# Altium schematic sheet fat41.SchDoc
size A3
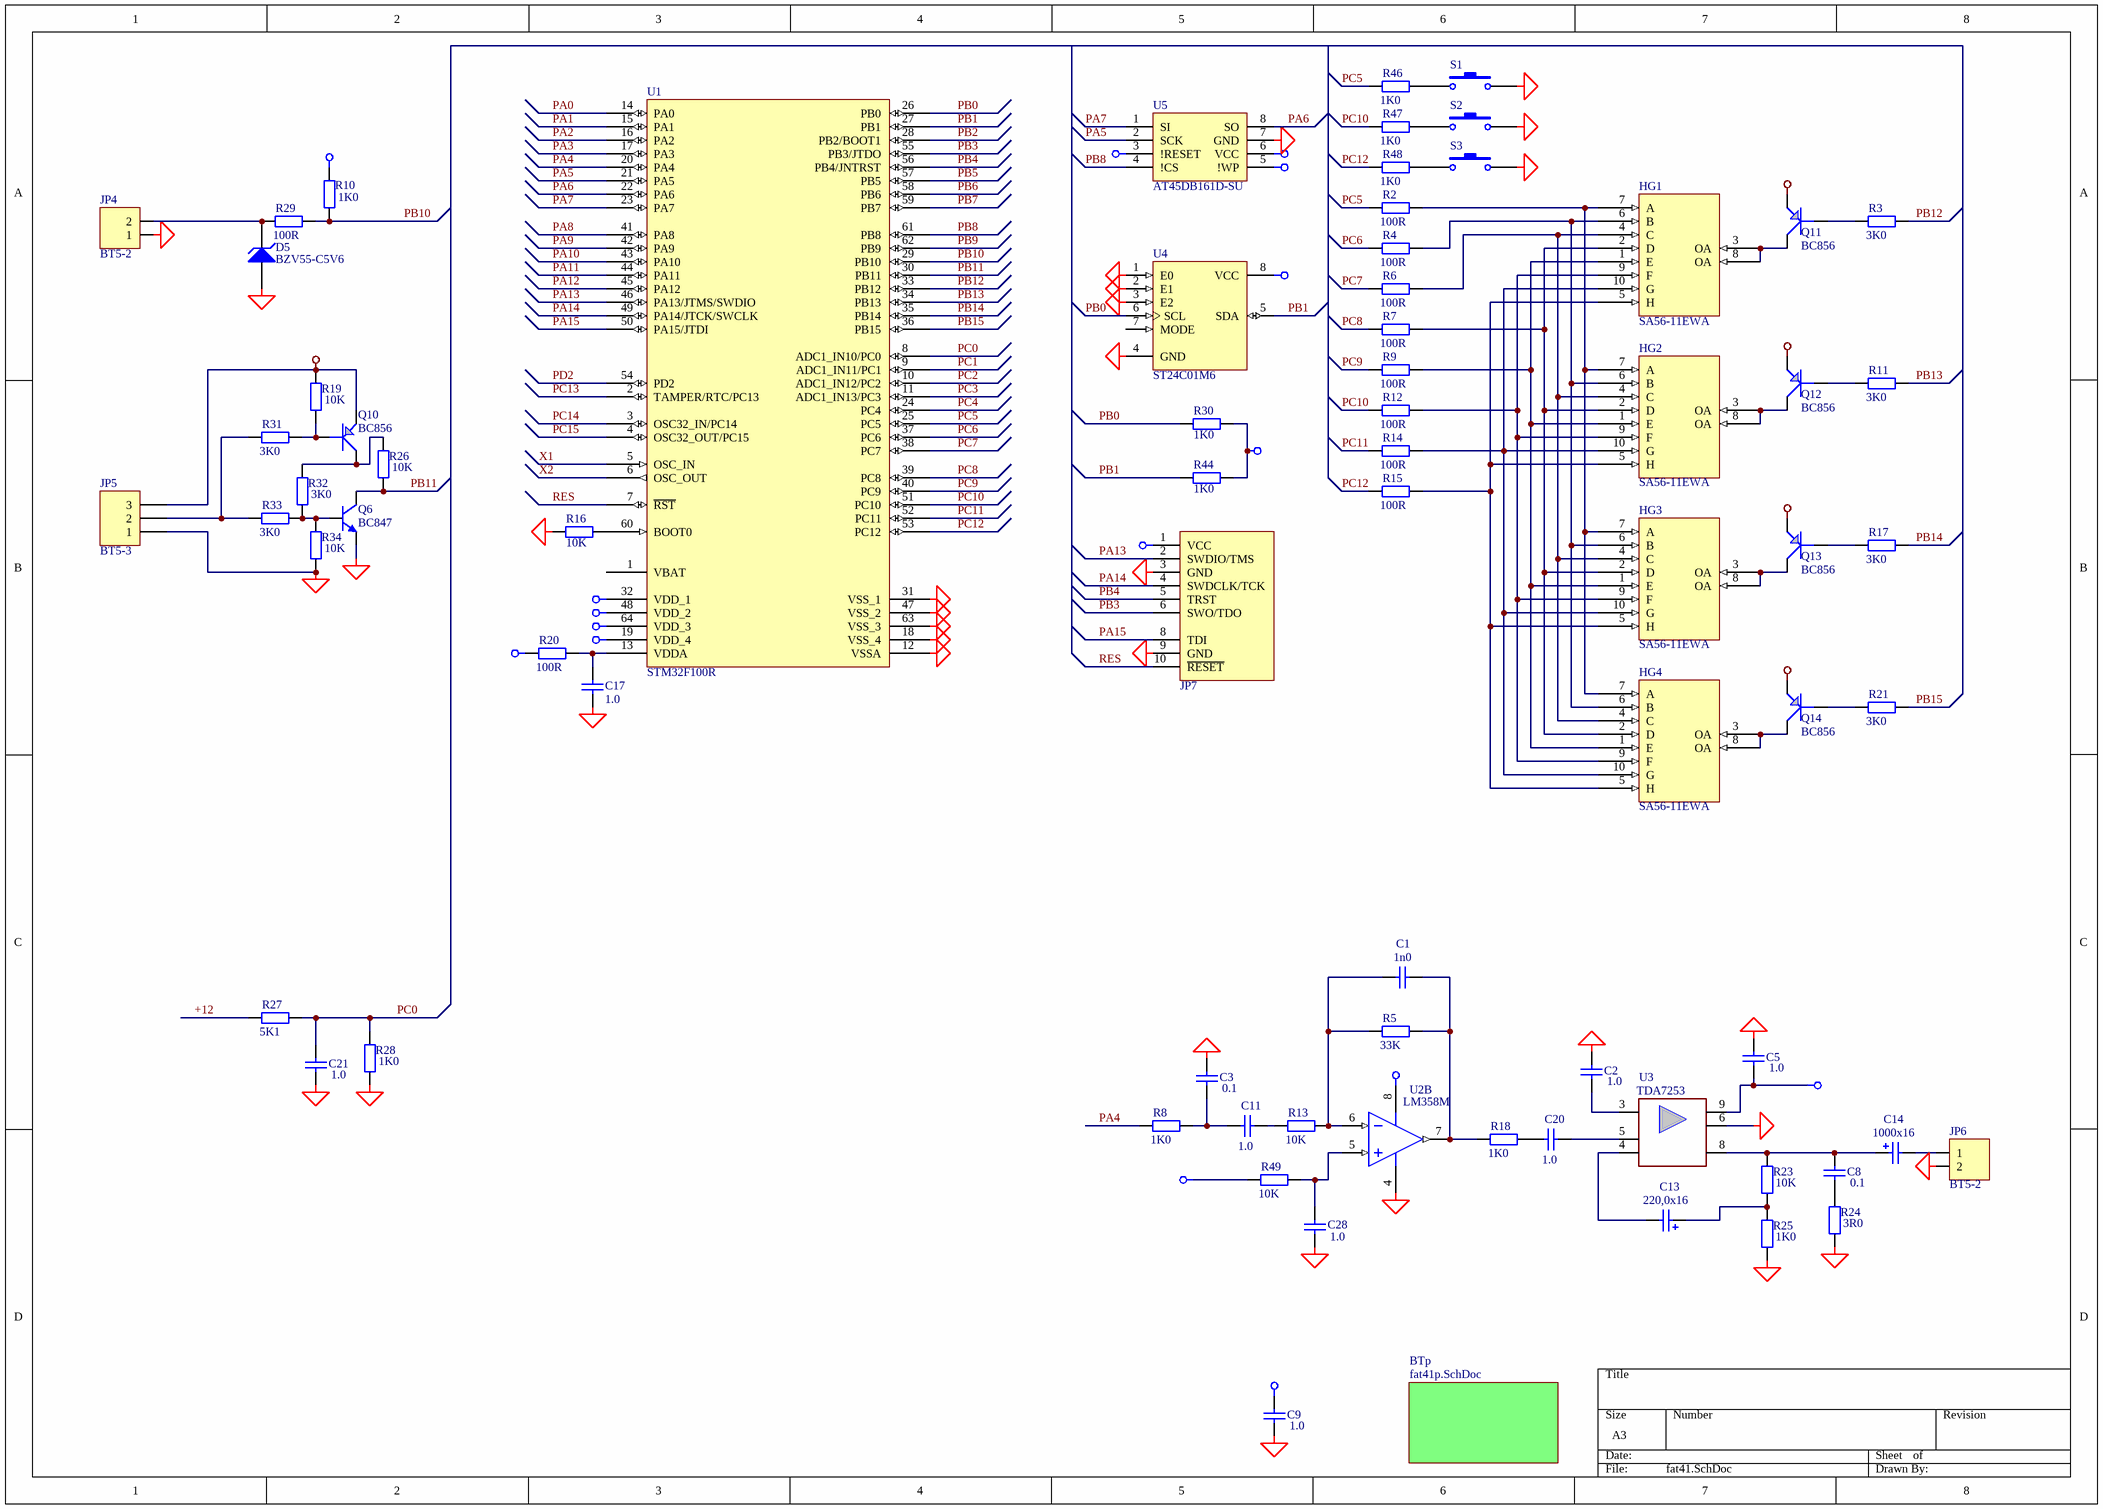
[diagram p0: fat41.SchDoc]

## Parts
C1  1n0  [_1206]
C2  1.0  [C3216-1206]
C3  0.1  [_1206]
C5  1.0  [C3216-1206]
C8  0.1  [C3216-1206]
C9  1.0  [C3216-1206]
C11  1.0  [_1206]
C13  220,0x16  [el3]
C14  1000x16  [el5]
C17  1.0  [_1206]
C20  1.0  [_1206]
C21  1.0  [_1206]
C28  1.0  [_1206]
D5  BZV55-C5V6  [_1206d]
HG1  SA56-11EWA  [DIP10]
HG2  SA56-11EWA  [DIP10]
HG3  SA56-11EWA  [DIP10]
HG4  SA56-11EWA  [DIP10]
JP4  BT5-2  [BT5-2-1]
JP5  BT5-3  [BT5-3]
JP6  BT5-2  [BT5-2-1]
JP7  CORTEX_DEBUG_CONNECTOR_PAL  [CORTEX_DEBUG_CONNECTOR]  (value not drawn)
Q6  BC847  [SO-G3]
Q10  BC856  [SO-G3]
Q11  BC856  [SO-G3]
Q12  BC856  [SO-G3]
Q13  BC856  [SO-G3]
Q14  BC856  [SO-G3]
R2  100R  [_1206]
R3  3K0  [_1206]
R4  100R  [_1206]
R5  33K  [_1206]
R6  100R  [_1206]
R7  100R  [_1206]
R8  1K0  [_1206]
R9  100R  [_1206]
R10  1K0  [_1206]
R11  3K0  [_1206]
R12  100R  [_1206]
R13  10K  [_1206]
R14  100R  [_1206]
R15  100R  [_1206]
R16  10K  [_1206]
R17  3K0  [_1206]
R18  1K0  [_1206]
R19  10K  [_1206]
R20  100R  [_1206]
R21  3K0  [_1206]
R23  10K  [_1206]
R24  3R0  [_1206]
R25  1K0  [_1206]
R26  10K  [_1206]
R27  5K1  [_1206]
R28  1K0  [_1206]
R29  100R  [_1206]
R30  1K0  [_1206]
R31  3K0  [_1206]
R32  3K0  [_1206]
R33  3K0  [_1206]
R34  10K  [_1206]
R44  1K0  [_1206]
R46  1K0  [_1206]
R47  1K0  [_1206]
R48  1K0  [_1206]
R49  10K  [_1206]
S1  SWT-6  [SWT-6-9]  (value not drawn)
S2  SWT-6  [SWT-6-9]  (value not drawn)
S3  SWT-6  [SWT-6-9]  (value not drawn)
U1  STM32F100R  [F-QFP10X10-G64/N]
U2  LM358M  [SO-G8]  (part B of 2)
U3  TDA7253  [Clipwatt11]
U4  ST24C01M6  [SO-G8]
U5  AT45DB161D-SU  [at45w]

## Sub-sheets
BTp = fat41p.SchDoc: no entries

## Nets
+3v3: C9.2 JP7.1(VCC) Q11.2(E) Q12.2(E) Q13.2(E) Q14.2(E) R10.1 R20.2 R30.2 R44.2 R49.2 U1.19(VDD_4) U1.32(VDD_1) U1.48(VDD_2) U1.64(VDD_3) U4.8(VCC) U5.3(!RESET) U5.5(!WP) U5.6(VCC)
+12v: C5.1 JP5.3 Q10.2(E) R19.2 U2.8(V+) U3.9
GND: C2.2 C3.2 C5.2 C9.1 C17.2 C21.1 C28.2 D5.1(A) JP4.1 JP5.1 JP6.2 JP7.3(GND) JP7.9(GND) Q6.2(E) R16.1 R24.1 R25.1 R28.2 R34.2 S1.2 S2.2 S3.2 U1.12(VSSA) U1.18(VSS_4) U1.31(VSS_1) U1.47(VSS_2) U1.63(VSS_3) U2.4(GND) U3.6 U4.1(E0) U4.2(E1) U4.3(E2) U4.4(GND) U5.7(GND)
+12: R27.2
PA0: U1.14(PA0)
PA1: U1.15(PA1)
PA2: U1.16(PA2)
PA3: U1.17(PA3)
PA4: R8.2 U1.20(PA4)
PA5: U1.21(PA5) U5.2(SCK)
PA6: U1.22(PA6) U5.8(SO)
PA7: U1.23(PA7) U5.1(SI)
PA8: U1.41(PA8)
PA9: U1.42(PA9)
PA10: U1.43(PA10)
PA11: U1.44(PA11)
PA12: U1.45(PA12)
PA13: JP7.2(SWDIO/TMS) U1.46(PA13/JTMS/SWDIO)
PA14: JP7.4(SWDCLK/TCK) U1.49(PA14/JTCK/SWCLK)
PA15: JP7.8(TDI) U1.50(PA15/JTDI)
PB0: R30.1 U1.26(PB0) U4.6(SCL)
PB1: R44.1 U1.27(PB1) U4.5(SDA)
PB2: U1.28(PB2/BOOT1)
PB3: JP7.6(SWO/TDO) U1.55(PB3/JTDO)
PB4: JP7.5(TRST) U1.56(PB4/JNTRST)
PB5: U1.57(PB5)
PB6: U1.58(PB6)
PB7: U1.59(PB7)
PB8: U1.61(PB8) U5.4(!CS)
PB9: U1.62(PB9)
PB10: R10.2 R29.1 U1.29(PB10)
PB11: Q6.3(C) R26.2 U1.30(PB11)
PB12: R3.2 U1.33(PB12)
PB13: R11.2 U1.34(PB13)
PB14: R17.2 U1.35(PB14)
PB15: R21.2 U1.36(PB15)
PC0: C21.2 R27.1 R28.1 U1.8(ADC1_IN10/PC0)
PC1: U1.9(ADC1_IN11/PC1)
PC2: U1.10(ADC1_IN12/PC2)
PC3: U1.11(ADC1_IN13/PC3)
PC4: U1.24(PC4)
PC5: R2.1 R46.1 U1.25(PC5)
PC6: R4.1 U1.37(PC6)
PC7: R6.1 U1.38(PC7)
PC8: R7.1 U1.39(PC8)
PC9: R9.1 U1.40(PC9)
PC10: R12.1 R47.1 U1.51(PC10)
PC11: R14.1 U1.52(PC11)
PC12: R15.1 R48.1 U1.53(PC12)
PC13: U1.2(TAMPER/RTC/PC13)
PC14: U1.3(OSC32_IN/PC14)
PC15: U1.4(OSC32_OUT/PC15)
PD2: U1.54(PD2)
RES: JP7.10(~{RESET}) U1.7(~{RST})
X1: U1.5(OSC_IN)
X2: U1.6(OSC_OUT)
NetC1_1: C1.1 R5.1 R18.1 U2.7(OUT)
NetC1_2: C1.2 R5.2 R13.1 U2.6(IN-)
NetC2_1: C2.1 U3.3(MUTE)
NetC3_1: C3.1 C11.1 R8.1
NetC8_1: C8.1 R24.2
NetC8_2: C8.2 C14.1 R23.2 U3.8
NetC11_2: C11.2 R13.2
NetC13_1: C13.1 R23.1 R25.2
NetC13_2: C13.2 U3.4
NetC14_2: C14.2 JP6.1
NetC17_1: C17.1 R20.1 U1.13(VDDA)
NetC20_1: C20.1 R18.2
NetC20_2: C20.2 U3.5(+)
NetC28_1: C28.1 R49.1 U2.5(IN+)
NetD5_2: D5.2(K) JP4.2 R29.2
NetHG1_1: HG1.1(E) HG2.1(E) HG3.1(E) HG4.1(E) R9.2
NetHG1_2: HG1.2(D) HG2.2(D) HG3.2(D) HG4.2(D) R7.2
NetHG1_3: HG1.3(OA) HG1.8(OA) Q11.3(C)
NetHG1_4: HG1.4(C) HG2.4(C) HG3.4(C) HG4.4(C) R6.2
NetHG1_5: HG1.5(H) HG2.5(H) HG3.5(H) HG4.5(H) R15.2
NetHG1_6: HG1.6(B) HG2.6(B) HG3.6(B) HG4.6(B) R4.2
NetHG1_7: HG1.7(A) HG2.7(A) HG3.7(A) HG4.7(A) R2.2
NetHG1_9: HG1.9(F) HG2.9(F) HG3.9(F) HG4.9(F) R12.2
NetHG1_10: HG1.10(G) HG2.10(G) HG3.10(G) HG4.10(G) R14.2
NetHG2_3: HG2.3(OA) HG2.8(OA) Q12.3(C)
NetHG3_3: HG3.3(OA) HG3.8(OA) Q13.3(C)
NetHG4_3: HG4.3(OA) HG4.8(OA) Q14.3(C)
NetJP5_2: JP5.2 R31.2 R33.2
NetQ6_1: Q6.1(B) R32.2 R33.1 R34.1
NetQ10_1: Q10.1(B) R19.1 R31.1
NetQ10_3: Q10.3(C) R26.1 R32.1
NetQ11_1: Q11.1(B) R3.1
NetQ12_1: Q12.1(B) R11.1
NetQ13_1: Q13.1(B) R17.1
NetQ14_1: Q14.1(B) R21.1
NetR16_2: R16.2 U1.60(BOOT0)
NetR46_2: R46.2 S1.1
NetR47_2: R47.2 S2.1
NetR48_2: R48.2 S3.1

Not connected (* = marked no-connect by the designer): U1 1(VBAT); U4 7(MODE)

## Library data of the parts
C1 = Cap Semi: Capacitor (Semiconductor SIM Model); Manufacturer: Generic Components; Class I: Passive; Value: 1000; Published: 8-Jun-2000; Revision: July-2002: Re-released for DXP Platform.; Publisher: Altium Limited; Class II: Capacitor
C2 C3 C5 C8 C17 = Cap Semi: Capacitor (Semiconductor SIM Model); Manufacturer: Generic Components; Class I: Passive; Value: 0,1; Published: 8-Jun-2000; Revision: July-2002: Re-released for DXP Platform.; Publisher: Altium Limited; Class II: Capacitor
C9 C21 = Cap Semi: Capacitor (Semiconductor SIM Model); Manufacturer: Generic Components; Class I: Passive; Value: 1,0; Published: 8-Jun-2000; Revision: July-2002: Re-released for DXP Platform.; Publisher: Altium Limited; Class II: Capacitor
C11 C20 C28 = Cap Semi: Capacitor (Semiconductor SIM Model); Manufacturer: Generic Components; Class I: Passive; Published: 8-Jun-2000; Revision: July-2002: Re-released for DXP Platform.; Publisher: Altium Limited; Class II: Capacitor; Value: 1.0
C13 C14 = Cap Pol1: Polarized Capacitor (Radial); Manufacturer: Generic Components; Class I: Passive; Value: 220,0; Published: 8-Jun-2000; Revision: July-2002: Re-released for DXP Platform.; Publisher: Altium Limited; Class II: Capacitor
D5 = D Zener: Zener Diode; Manufacturer: Generic Components; Class I: Discrete; Class II: Diode - Zener; Published: 8-Jun-2000; Revision: July-2002: Re-released for DXP Platform.; Publisher: Altium Limited
HG1-HG4 = SA05: Right: 60; Bottom: 90
JP4 JP6 = BT5-2: Header, 3-Pin; Manufacturer: Generic Components; Class I: Connector; Revision: July-2002: Re-released for DXP Platform.; Publisher: Altium Limited
JP5 = Header 3: Header, 3-Pin; Manufacturer: Generic Components; Class I: Connector; Revision: July-2002: Re-released for DXP Platform.; Publisher: Altium Limited
Q6 = BC847ALT1: General Purpose Transistor NPN Silicon; Manufacturer: Motorola; Package Information: Latest Revision: 1997; Class I: Discrete; Class II: BJT - Low Power; Published: 29-Sep-2000; Revision: July-2002: Re-released for DXP Platform.; Datasheet: Latest Revision: 1997; Package Reference: 318-08; Publisher: Altium Limited
Q10-Q14 = GT109: Right: 20; Bottom: 20
R2 R4 R6 R7 R9 R12 R14 R15 = RES: Resistor; Manufacturer: Generic Components; Class I: Passive; Published: 8-Jun-2000; Revision: July-2002: Re-released for DXP Platform.; Publisher: Altium Limited; Class II: Resistor; Value: 100R
R3 R11 R17 R21 = RES: Resistor; Manufacturer: Generic Components; Class I: Passive; Value: 3K; Published: 8-Jun-2000; Revision: July-2002: Re-released for DXP Platform.; Publisher: Altium Limited; Class II: Resistor
R5 R13 R27 R28 R34 = Res2: Resistor; Manufacturer: Generic Components; Class I: Passive; Published: 8-Jun-2000; Revision: July-2002: Re-released for DXP Platform.; Publisher: Altium Limited; Class II: Resistor
  R5: Value: 33K
  R13 R34: Value: 10K
  R27: Value: 5K1
  R28: Value: 1K0
R8 R10 R18 R20 R29 R31-R33 R49 = Res2: Resistor; Manufacturer: Generic Components; Class I: Passive; Value: 1K; Published: 8-Jun-2000; Revision: July-2002: Re-released for DXP Platform.; Publisher: Altium Limited; Class II: Resistor
R16 R19 R23-R26 R30 R44 R46-R48 = RES: Resistor; Manufacturer: Generic Components; Class I: Passive; Value: 1K; Published: 8-Jun-2000; Revision: July-2002: Re-released for DXP Platform.; Publisher: Altium Limited; Class II: Resistor
S1-S3 = SWT-6: Switch; Manufacturer: Generic Components; Published: 24-Mar-1999; Revision: July-2002: Re-released for DXP Platform.; Publisher: Altium Limited
U1 = STM32F100R: STM32 ARM-based 32-bit MCU with 64 Kbytes Flash, 64-pin LQFP, Industrial Temperature; Published: *; DatasheetVersion: *; PackageVersion: *; PackageReference: *; Publisher: *; PackageDescription: *; ComponentLink1Description: *; ComponentLink1URL: *; ComponentLink2Description: *; ComponentLink2URL: *
U2 = LM358M: Low-Power Dual Operational Amplifier; Manufacturer: National Semiconductor; Package Information: Latest Revision: Sep-1997; Published: 15-Apr-2002; Datasheet: Latest Revision: Sep-1999; Package Reference: M08A; Publisher: Altium Limited; Class I: Amplifier; Class II: Operational Amplifier
U4 = ST24C01M6: Serial 1K (128 x 8) EEPROM; Manufacturer: ST-Microelectronics; Package Information: Latest Revision: Jul-1999; Class I: Memory; Published: 24-Aug-2001; Revision: July-2002: Re-released for DXP Platform.; Datasheet: Latest Revision: Nov-1997; Package Reference: SOP8; Publisher: Altium Limited; Class II: EEPROM